# Altium schematic sheet VibrationMonitorSPT.SchDoc
size Letter
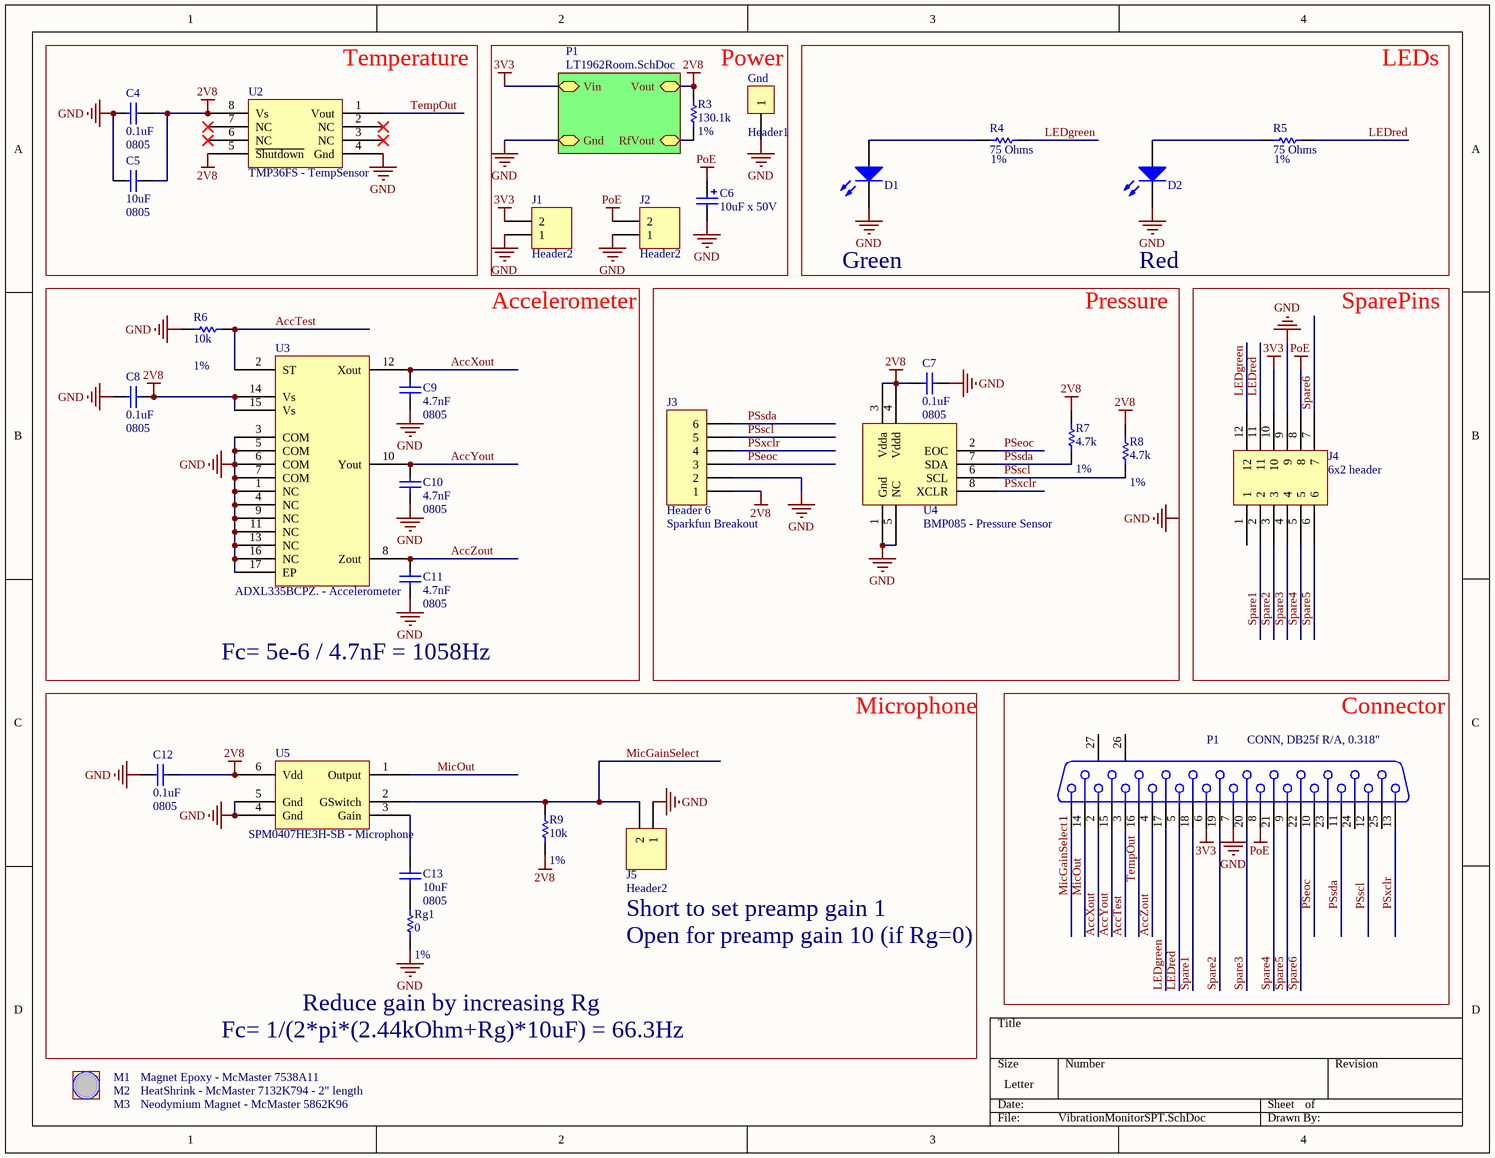
[diagram p0: VibrationMonitorSPT.SchDoc]

## Parts
C4  0.1uF  [0805]
C5  10uF  [0805]
C6  10uF x 50V  [CC4532-1812]
C7  0.1uF  [0805]
C8  0.1uF  [0805]
C9  4.7nF  [0805]
C10  4.7nF  [0805]
C11  4.7nF  [0805]
C12  0.1uF  [0805]
C13  10uF  [0805]
D1  LTST-S270KSKT, Yellow  [LED-S270KGKT]  (value not drawn)
D2  LTST-S270KSKT, Yellow  [LED-S270KGKT]  (value not drawn)
Gnd  Header1  [HDR1]
J1  Header2  [HDR1X2]
J2  Header2  [HDR1X2]
J3  Header 6  Assembly: Sparkfun Breakout  [HDR1X6]
J4  6x2 header  [HDR2X6]
J5  Header2  [HDR1X2]
M1  Magnet Epoxy - McMaster 7538A11
M2  HeatShrink - McMaster 7132K794 - 2" length
M3  Neodymium Magnet - McMaster 5862K96
P1  CONN, DB25f R/A, 0.318"  [DSUB1.385-2H25A]
R3  Param: 1%  [0805]  (hidden comment: 130.1k)
R4  75 Ohms  Param: 1%  [0805]
R5  75 Ohms  Param: 1%  [0805]
R6  10k  Param: 1%  [0805]
R7  4.7k  Param: 1%  [0603]
R8  4.7k  Param: 1%  [0603]
R9  10k  Param: 1%  [0603]
Rg1  0  Param: 1%  [0805]
U2  TMP36FS - TempSensor  [SO8/L200]
U3  ADXL335BCPZ. - Accelerometer  [ADXL335]
U4  BMP085 - Pressure Sensor  [BMP085]
U5  SPM0407HE3H-SB - Microphone  [SPM0407HE3H-SB]

## Blocks framed on the sheet
Temperature: C4 C5 U2
Power: C6 Gnd J1 J2 R3
SparePins: J4
Connector: P1

## Sub-sheets
P1 = LT1962Room.SchDoc: Gnd, Vin, RfVout, Vout

## Nets
2V8: C4.1 C5.1 C7.2 C8.1 C12.1 J3.1 R3.2 R7.1 R8.1 R9.1 U2.5(~{Shutdown}) U2.8(Vs) U3.14(Vs) U3.15(Vs) U4.3(Vdda) U4.4(Vddd) U5.6(Vdd) ; sheet P1/Vout
3V3: J1.2 J4.10 P1.6 ; sheet P1/Vin
GND: C4.2 C5.2 C6.2 C7.1 C8.2 C9.1 C10.1 C11.1 C12.2 D1.2(K) D2.2(K) Gnd.1 J1.1 J2.1 J3.2 J4.9 J5.1 P1.7 R6.2 Rg1.1 U2.4(Gnd) U3.1(NC) U3.3(COM) U3.4(NC) U3.5(COM) U3.6(COM) U3.7(COM) U3.9(NC) U3.11(NC) U3.13(NC) U3.16(NC) U3.17(EP) U4.1(Gnd) U4.5(NC) U5.4(Gnd) U5.5(Gnd) ; sheet P1/Gnd
PoE: C6.1 J2.2 J4.8 P1.8
AccTest: P1.3 R6.1 U3.2(ST)
AccXout: C9.2 P1.2 U3.12(Xout)
AccYout: C10.2 P1.15 U3.10(Yout)
AccZout: C11.2 P1.4 U3.8(Zout)
LEDgreen: J4.12 P1.17 R4.2
LEDred: J4.11 P1.5 R5.2
MicGainSelect: J5.2 P1.1 R9.2 U5.2(GSwitch)
MicOut: P1.14 U5.1(Output)
PSeoc: J3.3 P1.10 U4.2(EOC)
PSscl: J3.5 P1.12 R8.2 U4.6(SCL)
PSsda: J3.6 P1.11 R7.2 U4.7(SDA)
PSxclr: J3.4 P1.13 U4.8(XCLR)
Spare1: J4.2 P1.18
Spare2: J4.3 P1.19
Spare3: J4.4 P1.20
Spare4: J4.5 P1.21
Spare5: J4.6 P1.9
Spare6: J4.7 P1.22
TempOut: P1.16 U2.1(Vout)
NetC13_1: C13.1 U5.3(Gain)
NetC13_2: C13.2 Rg1.2
NetD1_1: D1.1(A) R4.1
NetD2_1: D2.1(A) R5.1
NetR3_1: R3.1 ; sheet P1/RfVout

Not connected (* = marked no-connect by the designer): J4 1; P1 23 24 25 26(MH1) 27(MH2); U2 2(NC)* 3(NC)* 6(NC)* 7(NC)*

## Notes on the sheet
- LEDs
- Green
- Red
- Accelerometer
- Pressure
- Fc= 5e-6 / 4.7nF = 1058Hz
- Microphone
- Short to set preamp gain 1
- Open for preamp gain 10 (if Rg=0)
- Fc= 1/(2*pi*(2.44kOhm+Rg)*10uF) = 66.3Hz
- Reduce gain by increasing Rg
- Labels drawn without touching a wire or pin: GND

## Library data of the parts
C4 C5 C7-C13 = Cap0603: Capacitor, Ceramic, 0603; TechInf: *; Param1: *
C6 = Cap Pol3: CAP POL C4532X5R1C336M; Published: 8-Jun-2000; LatestRevisionDate: 17-Jul-2002; LatestRevisionNote: Re-released for DXP Platform.; PackageReference: C0805; Publisher: Altium Limited
D1 = LED: LED Side View Yellow 0603; Manufacturer: Lite-On Inc; Manufacturers P/N: LTST-S270KGKT; Footprint: 0603
D2 = LED: LED Side View Yellow 0603; Manufacturer: Lite-On Inc; Manufacturers P/N: LTST-S270KRKT; Footprint: 0603
Gnd = Header1: TestPoint1; Footprint: *; Techinf: *
J3 = Header 6: Header, 0.1" 6-Pin straight; Publisher: *; Footprint`: *
J4 = Header6x2
M1 = MagnetEpoxy: Magnet Epoxy
M2 = VibesHeatshrink: Vibes board Heat Shrink
M3 = MagnetNeodymium: Neodymium Magnet
P1 = D Connector 25: Amp 5747846-4 or ITT DBMG25SJA197; PackageDocument: U; Positions: 25; Gender: Receptacle; Published: 15-Jun-2001; LatestRevisionDate: 17-Jul-2002; LatestRevisionNote: Re-released for DXP Platform.; DatasheetDocument: 19-Mar-1999; PackageReference: 787202; Publisher: Altium Limited; Orientation: Right Angle
R3 R6-R9 Rg1 = Res0603: Resistor; Param1: 100ppm/C; TechInfo: *
  R3: Value: 130.1k
  R6 R9: Value: 10k
  R7 R8: Value: 4.7k
  Rg1: Value: 0
R4 R5 = Res0603: Resistor; Param1: 100ppm/C; Value: 75; TechInfo: *
U2 = TMP36FS
U3 = ADXL335
U4 = BMP085
U5 = SPM0407HE3H-SB
J1 J2 J5 = Header2: Footprint: *; Techinf: *